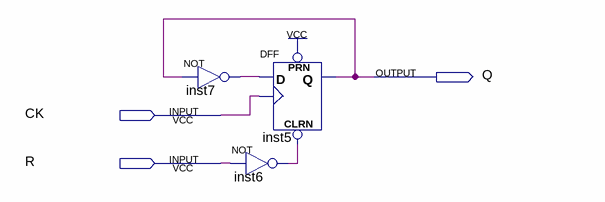
[diagram p0: schematic sheet]
// Quartus schematic jpd_freq_div_unit.bdf as structural Verilog: 3 symbols, 3 pins
module jpd_freq_div_unit (
  input  CK,
  input  R,
  output Q
);

  wire inst6_out, inst7_out;

  not inst7 (inst7_out, Q);
  DFF inst5 (.CLRN(inst6_out), .CLK(CK), .D(inst7_out), .PRN(1'b1), .Q(Q));
  not inst6 (inst6_out, R);
endmodule
